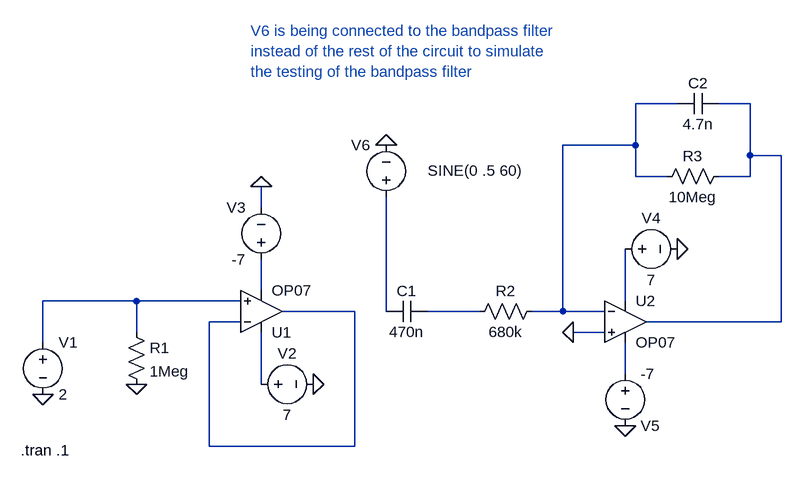
[diagram p0: schematic Piezo-Pulse-Sensor.asc]
Piezo-Pulse-Sensor.asc, the LTspice schematic file:
Version 4
SHEET 1 1316 680
WIRE 1152 -256 1088 -256
WIRE 1264 -256 1216 -256
WIRE 1088 -192 1088 -256
WIRE 1088 -192 976 -192
WIRE 1264 -176 1264 -256
WIRE 1312 -176 1264 -176
WIRE 1088 -144 1088 -192
WIRE 1136 -144 1088 -144
WIRE 1264 -144 1264 -176
WIRE 1264 -144 1216 -144
WIRE 512 -96 512 -128
WIRE 512 32 512 -16
WIRE 320 48 176 48
WIRE 480 48 320 48
WIRE 1072 48 1072 -32
WIRE 656 64 544 64
WIRE 704 64 704 -112
WIRE 848 64 768 64
WIRE 976 64 976 -192
WIRE 976 64 928 64
WIRE 1040 64 976 64
WIRE 480 80 432 80
WIRE 1312 80 1312 -176
WIRE 1312 80 1104 80
WIRE 320 96 320 48
WIRE 1040 96 992 96
WIRE 176 112 176 48
WIRE 1072 160 1072 112
WIRE 512 176 512 96
WIRE 432 272 432 80
WIRE 656 272 656 64
WIRE 656 272 432 272
FLAG 176 192 0
FLAG 320 176 0
FLAG 592 176 0
FLAG 512 -128 0
FLAG 992 96 0
FLAG 1152 -32 0
FLAG 1072 240 0
FLAG 704 -192 0
SYMBOL voltage 176 96 R0
WINDOW 123 0 0 Left 0
WINDOW 39 0 0 Left 0
SYMATTR InstName V1
SYMATTR Value 2
SYMBOL res 304 80 R0
SYMATTR InstName R1
SYMATTR Value 1Meg
SYMBOL Opamps\\OP07 512 128 M180
SYMATTR InstName U1
SYMBOL voltage 496 176 R270
WINDOW 0 32 56 VTop 2
WINDOW 3 -32 56 VBottom 2
WINDOW 123 0 0 Left 0
WINDOW 39 0 0 Left 0
SYMATTR InstName V2
SYMATTR Value 7
SYMBOL voltage 512 0 R180
WINDOW 0 24 96 Left 2
WINDOW 3 24 16 Left 2
WINDOW 123 0 0 Left 0
WINDOW 39 0 0 Left 0
SYMATTR InstName V3
SYMATTR Value -7
SYMBOL cap 768 48 R90
WINDOW 0 0 32 VBottom 2
WINDOW 3 32 32 VTop 2
SYMATTR InstName C1
SYMATTR Value 470n
SYMBOL res 944 48 R90
WINDOW 0 0 56 VBottom 2
WINDOW 3 32 56 VTop 2
SYMATTR InstName R2
SYMATTR Value 680k
SYMBOL Opamps\\OP07 1072 16 R0
SYMATTR InstName U2
SYMBOL voltage 1056 -32 R270
WINDOW 0 32 56 VTop 2
WINDOW 3 -32 56 VBottom 2
WINDOW 123 0 0 Left 0
WINDOW 39 0 0 Left 0
SYMATTR InstName V4
SYMATTR Value 7
SYMBOL voltage 1072 144 R0
WINDOW 0 24 96 Left 2
WINDOW 3 24 16 Left 2
WINDOW 123 0 0 Left 0
WINDOW 39 0 0 Left 0
SYMATTR InstName V5
SYMATTR Value -7
SYMBOL res 1232 -160 R90
WINDOW 0 0 56 VBottom 2
WINDOW 3 32 56 VTop 2
SYMATTR InstName R3
SYMATTR Value 10Meg
SYMBOL cap 1216 -272 R90
WINDOW 0 0 32 VBottom 2
WINDOW 3 32 32 VTop 2
SYMATTR InstName C2
SYMATTR Value 4.7n
SYMBOL voltage 704 -96 R180
WINDOW 0 24 96 Left 2
WINDOW 3 -210 57 Left 2
WINDOW 123 0 0 Left 0
WINDOW 39 0 0 Left 0
SYMATTR InstName V6
SYMATTR Value SINE(0 .5 60)
TEXT 496 -368 Left 2 ;V6 is being connected to the bandpass filter\ninstead of the rest of the circuit to simulate \nthe testing of the bandpass filter
TEXT 142 278 Left 2 !.tran .1

The netlist it stands for:
* Piezo-Pulse-Sensor.asc
V1 N004 0 2
R1 N004 0 1Meg
XU1 N004 N006 N010 N003 N006 LT1001  ; OP07, pins In+ In- V+ V- OUT
V2 N010 0 7
V3 N003 0 -7
C1 N008 N007 470n
R2 N001 N008 680k
XU2 0 N001 N005 N009 N002 LT1001  ; OP07, pins In+ In- V+ V- OUT
V4 N005 0 7
V5 N009 0 -7
R3 N002 N001 10Meg
C2 N002 N001 4.7n
V6 N007 0 SINE(0 .5 60)
* V6 is being connected to the bandpass filter
* instead of the rest of the circuit to simulate
* the testing of the bandpass filter
.tran .1
.lib LTC.lib
.backanno
.end